# Altium project LEDMatrix-PCB.PrjPcb
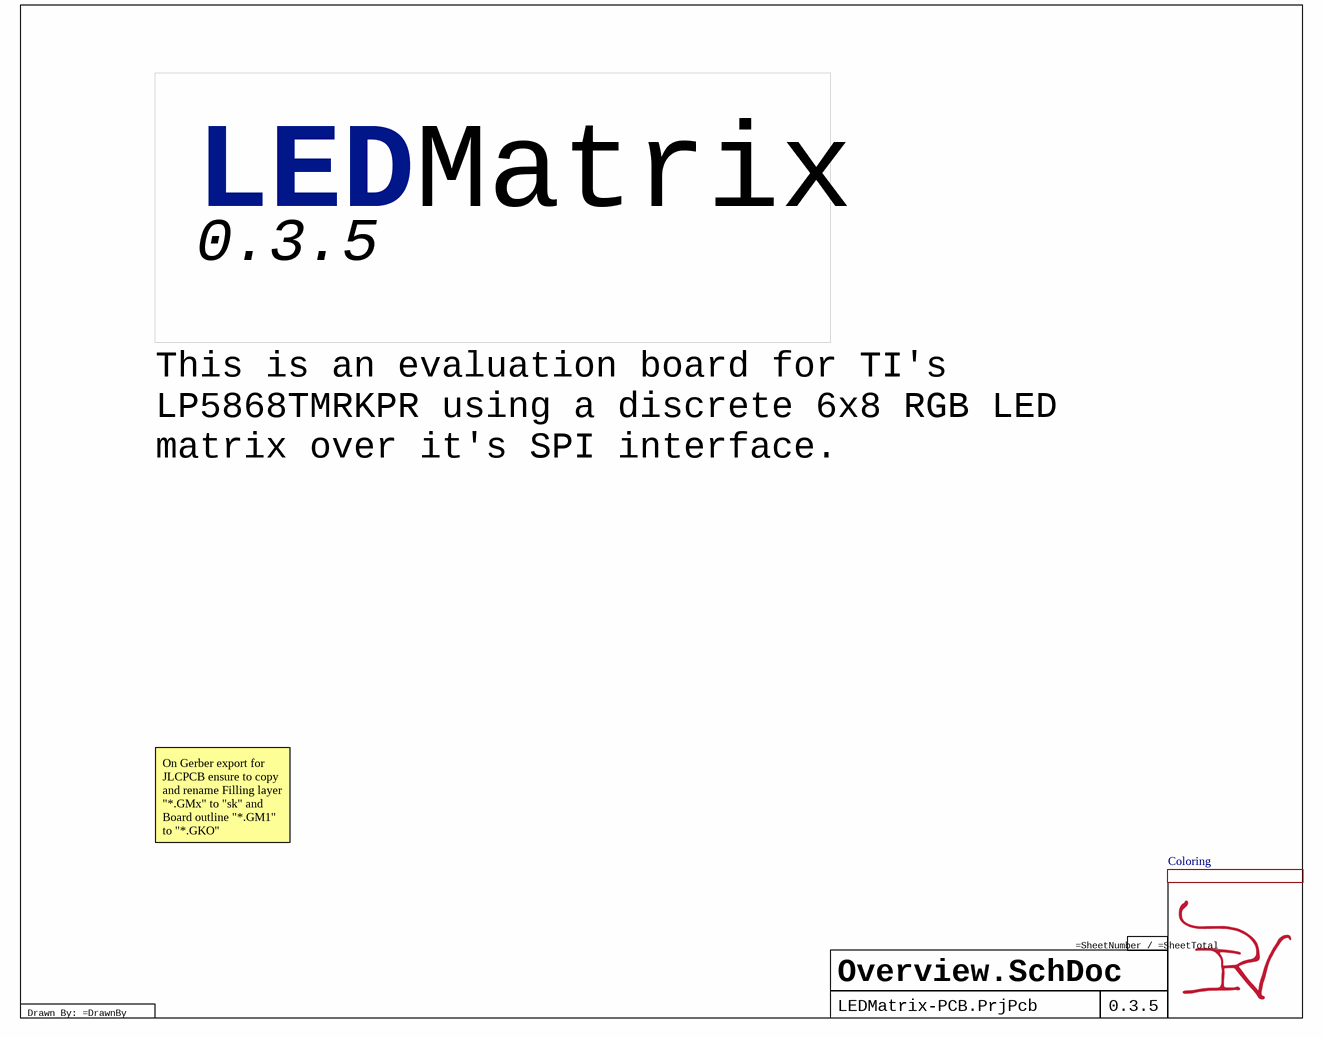
[diagram p0: Overview.SchDoc]
Version: 0.3.5; Project: LEDMatrix; LicenceYear: Copyright © 2024; Licence: Licenced under CERN-OHL-P v2; DrawnBy: IR; Author: IR
6 sheets, 59 parts. Net scope: flat (ports and power ports of the same name join across sheets).
Board file: LEDMatrix.PcbDoc
Sheets:
  Overview.SchDoc
    LINK_ME_AND_HIDE_DESIGNATOR = LEDMatrix.SchDoc
      Controller = Controller.SchDoc
      Matrix = Matrix.SchDoc
      Connectors = Connectors.SchDoc
    Coloring = Coloring.SchDoc

## Sheet Overview.SchDoc: PMPi-PCB
size A; SheetNumber: 1; SheetTotal: 6

### Sub-sheets
Coloring = Coloring.SchDoc: no entries
LINK_ME_AND_HIDE_DESIGNATOR = LEDMatrix.SchDoc: no entries

### Notes on the sheet
- LED
- This is an evaluation board for TI's LP5868TMRKPR using a discrete 6x8 RGB LED matrix over it's SPI interface.
- On Gerber export for JLCPCB ensure to copy and rename Filling layer "*.GMx" to "sk" and Board outline "*.GM1" to "*.GKO"
- Drawn By: =DrawnBy

## Sheet LEDMatrix.SchDoc
size A; SheetNumber: 2; SheetTotal: 6
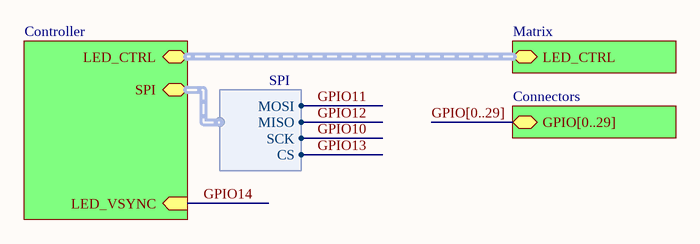
[diagram p1: LEDMatrix.SchDoc]

### Sub-sheets
Connectors = Connectors.SchDoc: GPIO[0..29] (bidir)
Controller = Controller.SchDoc: LED_CTRL (bidir, harness LED_CTRL), LED_VSYNC (in), SPI (bidir, harness SPI)
Matrix = Matrix.SchDoc: LED_CTRL (bidir, harness LED_CTRL)

### Harnesses
SPI: MOSI, MISO, SCK, CS

### Buses and harness runs
bus GPIO[0..29] = sheet Connectors/GPIO[0..29]
harness sheet Controller/LED_CTRL = sheet Matrix/LED_CTRL

### Notes on the sheet
- Drawn By: =DrawnBy

## Sheet Controller.SchDoc
size A; SheetNumber: 4; SheetTotal: 6
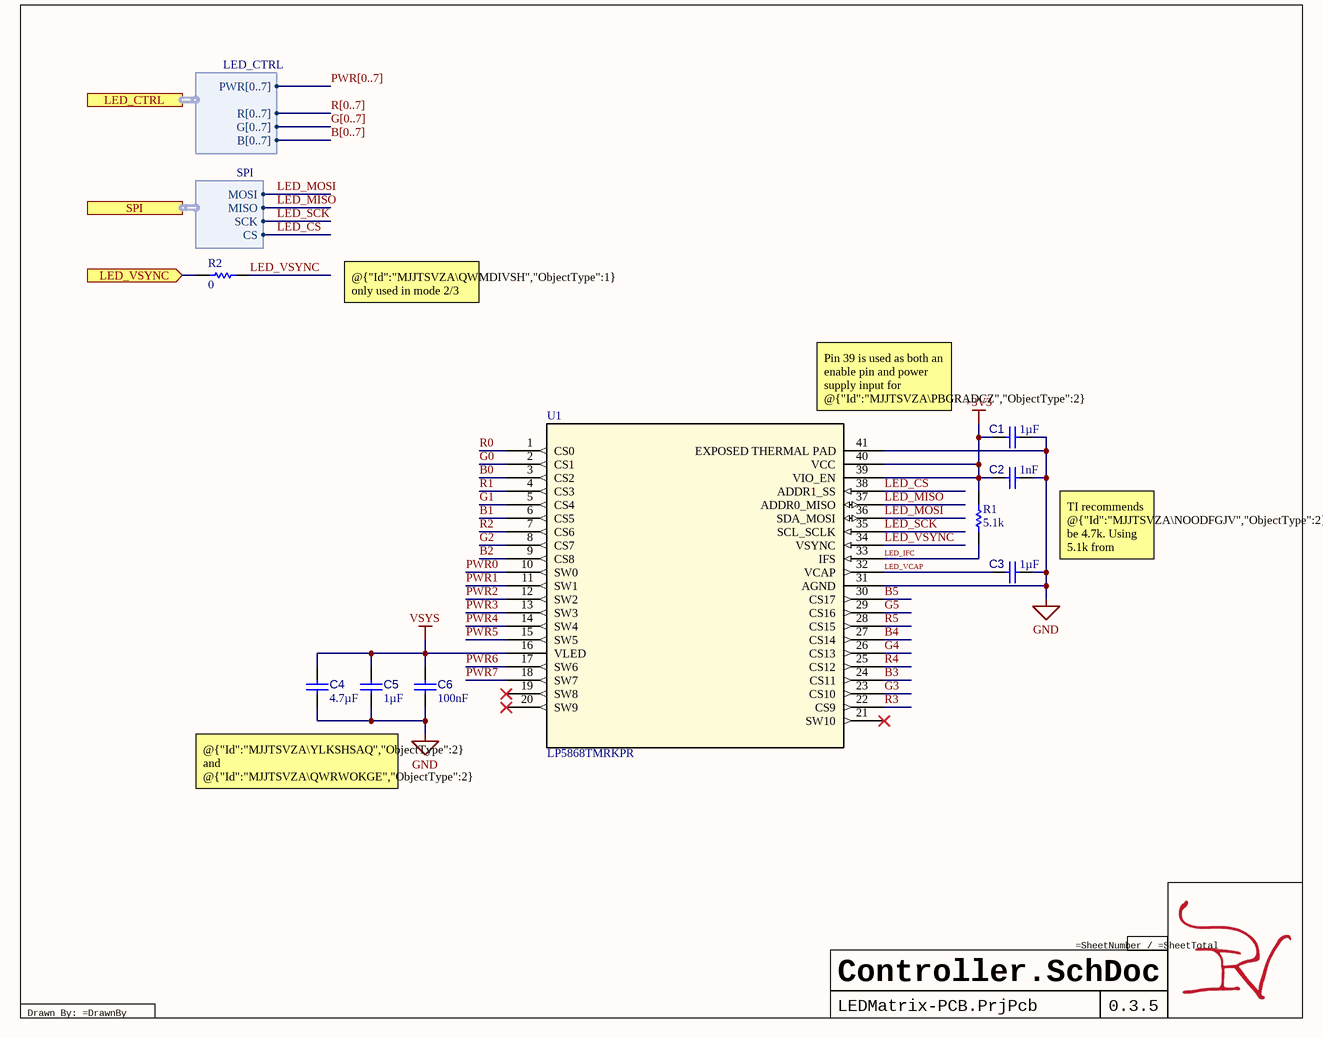
[diagram p2: Controller.SchDoc]

### Parts
C1  value 1µF  [CAP 0201_0603]  (hidden comment: GRM033R60J105MEA2D)
C2  value 1nF  [CAP 0402_1005]  (hidden comment: GRM1555C1H102JA01D)
C3  value 1µF  [CAP 0201_0603]  (hidden comment: GRM033R60J105MEA2D)
C4  value 4.7µF  [CAP 0402_1005]  (hidden comment: CL05A475MP5NRNC)
C5  value 1µF  [CAP 0201_0603]  (hidden comment: GRM033R60J105MEA2D)
C6  value 100nF  [CAP 0201_0603]  (hidden comment: CL03A104KQ3NNNC)
R1  value 5.1k  [RES 0201_0603]  (hidden comment: 5k1-0201-0.05/1)
R2  value 0  [RES 0402_1005]  (hidden comment: 0-0402-0.1)
U1  LP5868TMRKPR  [VQFN40-RKP_TEX]

### Ports
LED_CTRL (harness LED_CTRL, see LEDMatrix[2B], Matrix[1A]), LED_VSYNC (in, see LEDMatrix[2B]), SPI (harness SPI, see LEDMatrix[2B])

### Harnesses
LED_CTRL: PWR[0..7], R[0..7], B[0..7], G[0..7]
SPI: MOSI, MISO, SCK, CS

### Nets
+3V3: C1.2 C2.2 R1.2 U1.39(VIO_EN) U1.40(VCC)
GND: C1.1 C2.1 C3.2 C4.2 C5.1 C6.1 U1.31(AGND) U1.41(EXPOSED_THERMAL_PAD)
VSYS: C4.1 C5.2 C6.2 U1.16(VLED)
B0: U1.3(CS2)
B1: U1.6(CS5)
B2: U1.9(CS8)
B3: U1.24(CS11)
B4: U1.27(CS14)
B5: U1.30(CS17)
G0: U1.2(CS1)
G1: U1.5(CS4)
G2: U1.8(CS7)
G3: U1.23(CS10)
G4: U1.26(CS13)
G5: U1.29(CS16)
LED_CS: U1.38(ADDR1_SS) ; port SPI.CS
LED_IFC: R1.1 U1.33(IFS)
LED_MISO: U1.37(ADDR0_MISO) ; port SPI.MISO
LED_MOSI: U1.36(SDA_MOSI) ; port SPI.MOSI
LED_SCK: U1.35(SCL_SCLK) ; port SPI.SCK
LED_VCAP: C3.1 U1.32(VCAP)
LED_VSYNC: R2.2 U1.34(VSYNC)
LED_VSYNC: R2.1 ; port LED_VSYNC  [a separate net that carries the same name]
PWR0: U1.10(SW0)
PWR1: U1.11(SW1)
PWR2: U1.12(SW2)
PWR3: U1.13(SW3)
PWR4: U1.14(SW4)
PWR5: U1.15(SW5)
PWR6: U1.17(SW6)
PWR7: U1.18(SW7)
R0: U1.1(CS0)
R1: U1.4(CS3)
R2: U1.7(CS6)
R3: U1.22(CS9)
R4: U1.25(CS12)
R5: U1.28(CS15)

Not connected (* = marked no-connect by the designer): U1 19(SW8)* 20(SW9)* 21(SW10)*

### Buses and harness runs
bus B[0..7]
bus G[0..7]
bus PWR[0..7]
bus R[0..7]

### Notes on the sheet
- @{"Id":"MJJTSVZA\QWMDIVSH","ObjectType":1} only used in mode 2/3
- Pin 39 is used as both an enable pin and power supply input for @{"Id":"MJJTSVZA\PBGRADCZ","ObjectType":2} digital circuits
- TI recommends @{"Id":"MJJTSVZA\NOODFGJV","ObjectType":2} be 4.7k. Using 5.1k from @{"Id":"WRNONFHP\BOMUHTAU","ObjectType":2}
- @{"Id":"MJJTSVZA\YLKSHSAQ","ObjectType":2} and @{"Id":"MJJTSVZA\QWRWOKGE","ObjectType":2} were not in typical circuit, but have been added to help with power input from USB
- Drawn By: =DrawnBy

### Library data of the parts
C1 C3 C5 = CMP-001-00030-2: Ceramic Capacitor, Multilayer, Ceramic, 6.3V, 20% +Tol, 20% -Tol, X5R, 15% TC, 1uF, Surface Mount, 0201; Multilayer: Yes; Reach SVHC Compliant: Yes; Min Operating Temperature: -55°C; Mounting Technology: Surface Mount; Temperature Characteristics Code: X5R; Tolerance (fill in as +-): 20%; Capacitor Type: Ceramic; Pins: 2; Tolerance  (fill in as +-): 20%; RoHS Compliant: Yes; JESD-609 Code: e3; Package Shape: Rectangular; Dielectric Material: Ceramic; Max Operating Temperature: 85°C; Packaging: Tape and Reel; Terminal Finish: Nickel; Rated DC Voltage (URdc): 6.3V; Case/Package: 0201; Termination: Wraparound
C2 = CMP-001-00027-1: Ceramic Capacitor, Multilayer, Ceramic, 50V, 5% +Tol, 5% -Tol, C0G, 30ppm/Cel TC, 0.001uF, Surface Mount, 0402; Multilayer: Yes; Case/Package: 0402; Tolerance  (fill in as +-): 5%; Capacitor Type: Ceramic; Height: 0.5mm; Rated DC Voltage (URdc): 50V; Terminal Finish: Nickel; Tolerance (fill in as +-): 5%; RoHS Compliant: Yes; Package Shape: Rectangular; Length: 1mm; Package Style: SMTMeter; Packaging: Tape and Reel; Max Operating Temperature: 125°C; Temperature Characteristics Code: C0G; Pins: 2; Mounting Technology: Surface Mount; Termination: Wraparound; JESD-609 Code: e3; Width: 0.5mm; Min Operating Temperature: -55°C; Dielectric Material: Ceramic; Reach SVHC Compliant: Yes
C4 = CMP-001-00020-1: Ceramic Capacitor, Multilayer, Ceramic, 10V, 20% +Tol, 20% -Tol, X5R, 15% TC, 4.7uF, Surface Mount, 0402; Multilayer: Yes; Terminal Finish: Nickel; JESD-609 Code: e3; Tolerance (fill in as +-): 20%; Case/Package: 0402; Max Operating Temperature: 85°C; Tolerance  (fill in as +-): 20%; Temperature Characteristics Code: X5R; Packaging: Tape and Reel; Mounting Technology: Surface Mount; Width: 0.5mm; Pins: 2; Min Operating Temperature: -55°C; Package Style: SMTMeter; Capacitor Type: Ceramic; RoHS Compliant: Yes; Height: 0.65mm; Rated DC Voltage (URdc): 10V; Termination: Wraparound; Dielectric Material: Ceramic; Reach SVHC Compliant: Yes; Package Shape: Rectangular; Length: 1mm
C6 = CMP-001-00029-1: Ceramic Capacitor, Multilayer, Ceramic, 6.3V, 10% +Tol, 10% -Tol, X5R, 15% TC, 0.1uF, Surface Mount, 0201; Multilayer: Yes; Temperature Characteristics Code: X5R; Capacitor Type: Ceramic; Min Operating Temperature: -55°C; Reach SVHC Compliant: Yes; Termination: Wraparound; Mounting Technology: Surface Mount; Terminal Finish: Nickel; Pins: 2; JESD-609 Code: e3; Rated DC Voltage (URdc): 6.3V; Case/Package: 0201; Packaging: Tape and Reel; Tolerance  (fill in as +-): 10%; Height: 0.3mm; Length: 0.6mm; Package Shape: Rectangular; Max Operating Temperature: 85°C; Package Style: SMTMeter; Tolerance (fill in as +-): 10%; RoHS Compliant: Yes; Dielectric Material: Ceramic; Width: 0.3mm
R1 = CMP-009-00053-1: Fixed Resistor, Metal Glaze/thick Film, 0.05W, 5100ohm, 25V, 1% +/-Tol, 200ppm/Cel, Surface Mount, 0201; Power: 50mW; Reference Standard: AEC-Q200; Temperature Coefficient: 200ppm/°C; Package Width: 0.3mm; Rated Temperature: 70°C; Package Height: 0.23mm; Package Length: 0.6mm; Min Operating Temperature: -55°C; Max Operating Temperature: 125°C; Tolerance: 1%; Pins: 2; Case/Package: 0201; Construction: Rectangular; Packaging: Tape and Reel; JESD-609 Code: e3; Terminal Finish: Nickel; Termination: Wraparound; Package Style: SMTMeter; Working Voltage: 25V; Package Shape: Rectangular; Resistor Type: FIXED RESISTOR; RoHS Compliant: Yes; Reach SVHC Compliant: Yes; Mounting Technology: Surface Mount; Technology: METAL GLAZE/THICK FILM
R2 = CMP-009-00062-1: Fixed Resistor, Metal Glaze/thick Film, 0.1W, 0ohm, Surface Mount, 0402; Package Width: 0.5mm; Power: 100mW; Tolerance: 1%; Rated Temperature: 70°C; Package Length: 1mm; Reference Standard: AEC-Q200; Package Height: 0.35mm; Temperature Coefficient: 100ppm/°C; Working Voltage: 50V; Min Operating Temperature: -55°C; Package Style: SMTMeter; Reach SVHC Compliant: Yes; Technology: METAL GLAZE/THICK FILM; Resistor Type: FIXED RESISTOR; JESD-609 Code: e3; Construction: Rectangular; Package Shape: Rectangular; RoHS Compliant: Yes; Pins: 2; Terminal Finish: Nickel; Case/Package: 0402; Max Operating Temperature: 155°C; Packaging: Tape and Reel; Termination: Wraparound; Mounting Technology: Surface Mount
U1 = CMP-776-000000-2: 8 x 18 high-current LED matrix driver with 8-bit analog and 8-/16-bit PWM dimming; Mfr_Name: Texas Instruments; RefDes: RefDes; Source: LP5868TMRKPR.SchLib; Type: Power Management; Design Item ID: LP5868TMRKPR

## Sheet Matrix.SchDoc
size A3; SheetNumber: 5; SheetTotal: 6
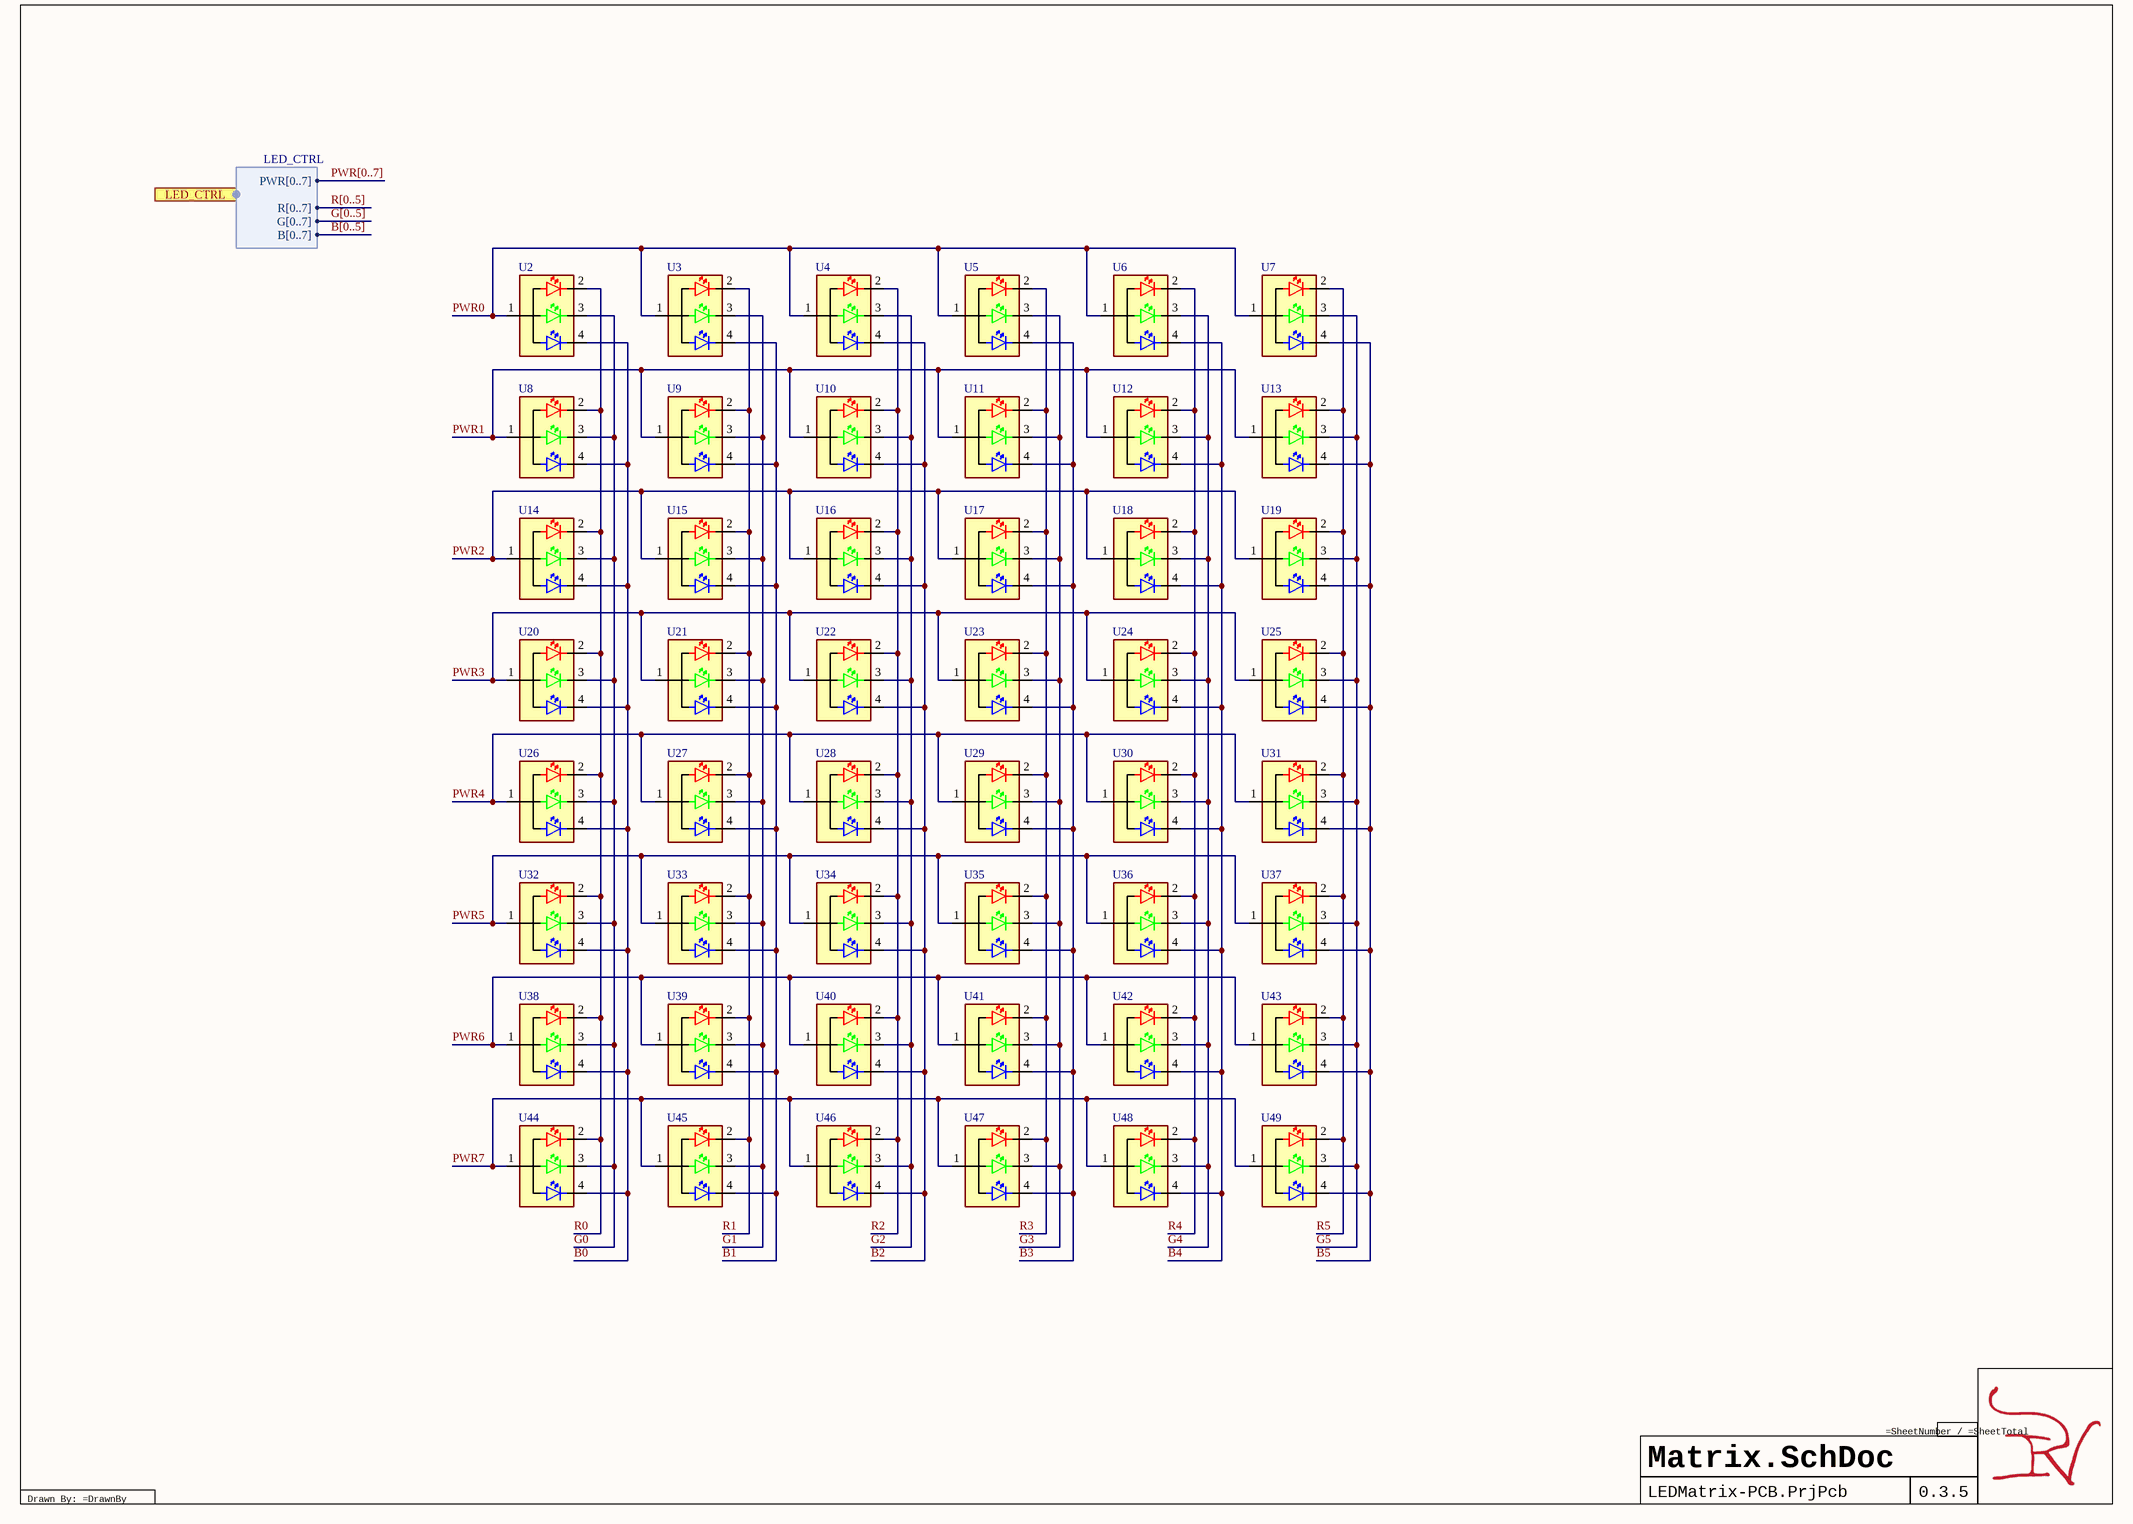
[diagram p3: Matrix.SchDoc]

### Parts
U2  B36J3RGB-F6C0001H4U1930  [B36J3RGB-F6C0001H4U1930-Footprint-1]  (value not drawn)
U3  B36J3RGB-F6C0001H4U1930  [B36J3RGB-F6C0001H4U1930-Footprint-1]  (value not drawn)
U4  B36J3RGB-F6C0001H4U1930  [B36J3RGB-F6C0001H4U1930-Footprint-1]  (value not drawn)
U5  B36J3RGB-F6C0001H4U1930  [B36J3RGB-F6C0001H4U1930-Footprint-1]  (value not drawn)
U6  B36J3RGB-F6C0001H4U1930  [B36J3RGB-F6C0001H4U1930-Footprint-1]  (value not drawn)
U7  B36J3RGB-F6C0001H4U1930  [B36J3RGB-F6C0001H4U1930-Footprint-1]  (value not drawn)
U8  B36J3RGB-F6C0001H4U1930  [B36J3RGB-F6C0001H4U1930-Footprint-1]  (value not drawn)
U9  B36J3RGB-F6C0001H4U1930  [B36J3RGB-F6C0001H4U1930-Footprint-1]  (value not drawn)
U10  B36J3RGB-F6C0001H4U1930  [B36J3RGB-F6C0001H4U1930-Footprint-1]  (value not drawn)
U11  B36J3RGB-F6C0001H4U1930  [B36J3RGB-F6C0001H4U1930-Footprint-1]  (value not drawn)
U12  B36J3RGB-F6C0001H4U1930  [B36J3RGB-F6C0001H4U1930-Footprint-1]  (value not drawn)
U13  B36J3RGB-F6C0001H4U1930  [B36J3RGB-F6C0001H4U1930-Footprint-1]  (value not drawn)
U14  B36J3RGB-F6C0001H4U1930  [B36J3RGB-F6C0001H4U1930-Footprint-1]  (value not drawn)
U15  B36J3RGB-F6C0001H4U1930  [B36J3RGB-F6C0001H4U1930-Footprint-1]  (value not drawn)
U16  B36J3RGB-F6C0001H4U1930  [B36J3RGB-F6C0001H4U1930-Footprint-1]  (value not drawn)
U17  B36J3RGB-F6C0001H4U1930  [B36J3RGB-F6C0001H4U1930-Footprint-1]  (value not drawn)
U18  B36J3RGB-F6C0001H4U1930  [B36J3RGB-F6C0001H4U1930-Footprint-1]  (value not drawn)
U19  B36J3RGB-F6C0001H4U1930  [B36J3RGB-F6C0001H4U1930-Footprint-1]  (value not drawn)
U20  B36J3RGB-F6C0001H4U1930  [B36J3RGB-F6C0001H4U1930-Footprint-1]  (value not drawn)
U21  B36J3RGB-F6C0001H4U1930  [B36J3RGB-F6C0001H4U1930-Footprint-1]  (value not drawn)
U22  B36J3RGB-F6C0001H4U1930  [B36J3RGB-F6C0001H4U1930-Footprint-1]  (value not drawn)
U23  B36J3RGB-F6C0001H4U1930  [B36J3RGB-F6C0001H4U1930-Footprint-1]  (value not drawn)
U24  B36J3RGB-F6C0001H4U1930  [B36J3RGB-F6C0001H4U1930-Footprint-1]  (value not drawn)
U25  B36J3RGB-F6C0001H4U1930  [B36J3RGB-F6C0001H4U1930-Footprint-1]  (value not drawn)
U26  B36J3RGB-F6C0001H4U1930  [B36J3RGB-F6C0001H4U1930-Footprint-1]  (value not drawn)
U27  B36J3RGB-F6C0001H4U1930  [B36J3RGB-F6C0001H4U1930-Footprint-1]  (value not drawn)
U28  B36J3RGB-F6C0001H4U1930  [B36J3RGB-F6C0001H4U1930-Footprint-1]  (value not drawn)
U29  B36J3RGB-F6C0001H4U1930  [B36J3RGB-F6C0001H4U1930-Footprint-1]  (value not drawn)
U30  B36J3RGB-F6C0001H4U1930  [B36J3RGB-F6C0001H4U1930-Footprint-1]  (value not drawn)
U31  B36J3RGB-F6C0001H4U1930  [B36J3RGB-F6C0001H4U1930-Footprint-1]  (value not drawn)
U32  B36J3RGB-F6C0001H4U1930  [B36J3RGB-F6C0001H4U1930-Footprint-1]  (value not drawn)
U33  B36J3RGB-F6C0001H4U1930  [B36J3RGB-F6C0001H4U1930-Footprint-1]  (value not drawn)
U34  B36J3RGB-F6C0001H4U1930  [B36J3RGB-F6C0001H4U1930-Footprint-1]  (value not drawn)
U35  B36J3RGB-F6C0001H4U1930  [B36J3RGB-F6C0001H4U1930-Footprint-1]  (value not drawn)
U36  B36J3RGB-F6C0001H4U1930  [B36J3RGB-F6C0001H4U1930-Footprint-1]  (value not drawn)
U37  B36J3RGB-F6C0001H4U1930  [B36J3RGB-F6C0001H4U1930-Footprint-1]  (value not drawn)
U38  B36J3RGB-F6C0001H4U1930  [B36J3RGB-F6C0001H4U1930-Footprint-1]  (value not drawn)
U39  B36J3RGB-F6C0001H4U1930  [B36J3RGB-F6C0001H4U1930-Footprint-1]  (value not drawn)
U40  B36J3RGB-F6C0001H4U1930  [B36J3RGB-F6C0001H4U1930-Footprint-1]  (value not drawn)
U41  B36J3RGB-F6C0001H4U1930  [B36J3RGB-F6C0001H4U1930-Footprint-1]  (value not drawn)
U42  B36J3RGB-F6C0001H4U1930  [B36J3RGB-F6C0001H4U1930-Footprint-1]  (value not drawn)
U43  B36J3RGB-F6C0001H4U1930  [B36J3RGB-F6C0001H4U1930-Footprint-1]  (value not drawn)
U44  B36J3RGB-F6C0001H4U1930  [B36J3RGB-F6C0001H4U1930-Footprint-1]  (value not drawn)
U45  B36J3RGB-F6C0001H4U1930  [B36J3RGB-F6C0001H4U1930-Footprint-1]  (value not drawn)
U46  B36J3RGB-F6C0001H4U1930  [B36J3RGB-F6C0001H4U1930-Footprint-1]  (value not drawn)
U47  B36J3RGB-F6C0001H4U1930  [B36J3RGB-F6C0001H4U1930-Footprint-1]  (value not drawn)
U48  B36J3RGB-F6C0001H4U1930  [B36J3RGB-F6C0001H4U1930-Footprint-1]  (value not drawn)
U49  B36J3RGB-F6C0001H4U1930  [B36J3RGB-F6C0001H4U1930-Footprint-1]  (value not drawn)

### Ports
LED_CTRL (harness LED_CTRL, see LEDMatrix[3B], Controller[1A])

### Harnesses
LED_CTRL: PWR[0..7], R[0..7], B[0..7], G[0..7]

### Nets
B0: U2.4 U8.4 U14.4 U20.4 U26.4 U32.4 U38.4 U44.4
B1: U3.4 U9.4 U15.4 U21.4 U27.4 U33.4 U39.4 U45.4
B2: U4.4 U10.4 U16.4 U22.4 U28.4 U34.4 U40.4 U46.4
B3: U5.4 U11.4 U17.4 U23.4 U29.4 U35.4 U41.4 U47.4
B4: U6.4 U12.4 U18.4 U24.4 U30.4 U36.4 U42.4 U48.4
B5: U7.4 U13.4 U19.4 U25.4 U31.4 U37.4 U43.4 U49.4
G0: U2.3 U8.3 U14.3 U20.3 U26.3 U32.3 U38.3 U44.3
G1: U3.3 U9.3 U15.3 U21.3 U27.3 U33.3 U39.3 U45.3
G2: U4.3 U10.3 U16.3 U22.3 U28.3 U34.3 U40.3 U46.3
G3: U5.3 U11.3 U17.3 U23.3 U29.3 U35.3 U41.3 U47.3
G4: U6.3 U12.3 U18.3 U24.3 U30.3 U36.3 U42.3 U48.3
G5: U7.3 U13.3 U19.3 U25.3 U31.3 U37.3 U43.3 U49.3
PWR0: U2.1 U3.1 U4.1 U5.1 U6.1 U7.1
PWR1: U8.1 U9.1 U10.1 U11.1 U12.1 U13.1
PWR2: U14.1 U15.1 U16.1 U17.1 U18.1 U19.1
PWR3: U20.1 U21.1 U22.1 U23.1 U24.1 U25.1
PWR4: U26.1 U27.1 U28.1 U29.1 U30.1 U31.1
PWR5: U32.1 U33.1 U34.1 U35.1 U36.1 U37.1
PWR6: U38.1 U39.1 U40.1 U41.1 U42.1 U43.1
PWR7: U44.1 U45.1 U46.1 U47.1 U48.1 U49.1
R0: U2.2 U8.2 U14.2 U20.2 U26.2 U32.2 U38.2 U44.2
R1: U3.2 U9.2 U15.2 U21.2 U27.2 U33.2 U39.2 U45.2
R2: U4.2 U10.2 U16.2 U22.2 U28.2 U34.2 U40.2 U46.2
R3: U5.2 U11.2 U17.2 U23.2 U29.2 U35.2 U41.2 U47.2
R4: U6.2 U12.2 U18.2 U24.2 U30.2 U36.2 U42.2 U48.2
R5: U7.2 U13.2 U19.2 U25.2 U31.2 U37.2 U43.2 U49.2

### Buses and harness runs
bus B[0..5]
bus G[0..5]
bus PWR[0..7]
bus R[0..5]

### Notes on the sheet
- Drawn By: =DrawnBy

### Library data of the parts
U2-U49 = CMP-007-00001-4: Led Rgb Common Anode (0.65(L)X 0

## Sheet Connectors.SchDoc
size A; SheetNumber: 5; SheetTotal: 6
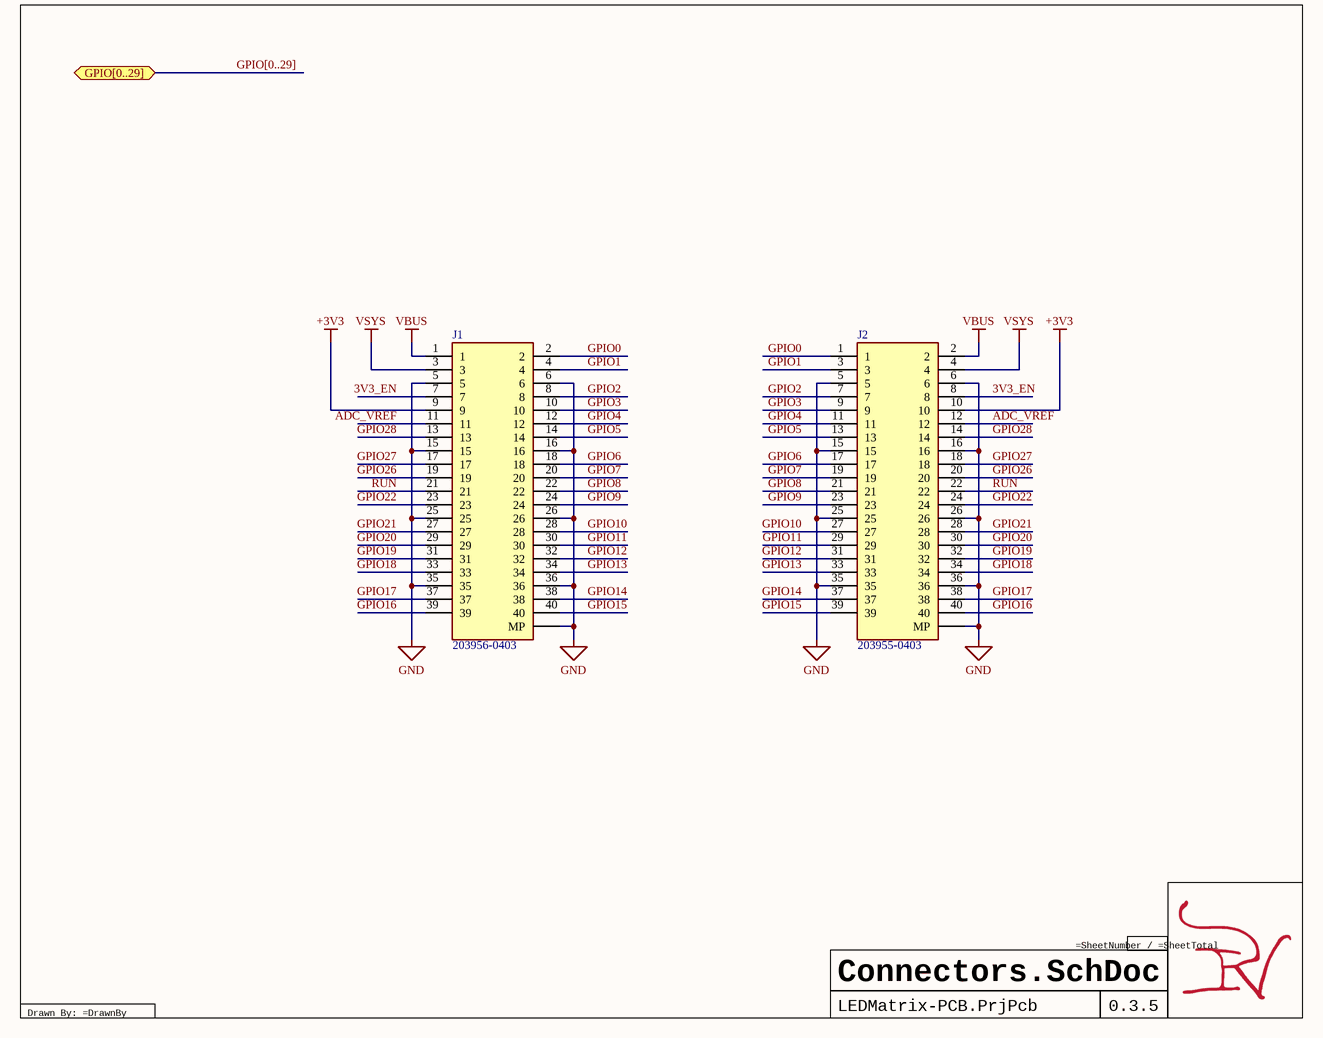
[diagram p4: Connectors.SchDoc]

### Parts
J1  203956-0403  [2039560403]
J2  203955-0403  [2039550403]

### Ports
GPIO[0..29] (bidir, see LEDMatrix[3B], Controller[1B])

### Nets
+3V3: J1.9 J2.10
GND: J1.5 J1.6 J1.15 J1.16 J1.25 J1.26 J1.35 J1.36 J1.MP1,_MP2,_MP3,_MP4(MP) J2.5 J2.6 J2.15 J2.16 J2.25 J2.26 J2.35 J2.36 J2.MP1,_MP2,_MP3,_MP4(MP)
VBUS: J1.1 J2.2
VSYS: J1.3 J2.4
3V3_EN: J1.7 J2.8
ADC_VREF: J1.11 J2.12
GPIO0: J1.2 J2.1
GPIO1: J1.4 J2.3
GPIO2: J1.8 J2.7
GPIO3: J1.10 J2.9
GPIO4: J1.12 J2.11
GPIO5: J1.14 J2.13
GPIO6: J1.18 J2.17
GPIO7: J1.20 J2.19
GPIO8: J1.22 J2.21
GPIO9: J1.24 J2.23
GPIO10: J1.28 J2.27
GPIO11: J1.30 J2.29
GPIO12: J1.32 J2.31
GPIO13: J1.34 J2.33
GPIO14: J1.38 J2.37
GPIO15: J1.40 J2.39
GPIO16: J1.39 J2.40
GPIO17: J1.37 J2.38
GPIO18: J1.33 J2.34
GPIO19: J1.31 J2.32
GPIO20: J1.29 J2.30
GPIO21: J1.27 J2.28
GPIO22: J1.23 J2.24
GPIO26: J1.19 J2.20
GPIO27: J1.17 J2.18
GPIO28: J1.13 J2.14
RUN: J1.21 J2.22

### Buses and harness runs
bus GPIO[0..29] = port GPIO[0..29]

### Notes on the sheet
- Drawn By: =DrawnBy

### Library data of the parts
J1 = CMP-702-000004-3: SlimStack Board-to-Board Plug, 0.40mm Pitch, FSB5 Floating Series, 5.00mm Mated Height, 3.80 Mated Width, 40 Circuits; Manufacturer_Name: Molex; Source: SamacSys.SchLib; Datasheet Link: https://www.molex.com/pdm_docs/sd/2039560403_sd.pdf; Height: 4.55mm; Design Item ID: 203956-0403; Manufacturer_Part_Number: 203956-0403; Mouser Price/Stock: https://www.mouser.co.uk/ProductDetail/Molex/203956-0403?qs=GBLSl2AkiruaR3IeSUTGlg%3D%3D; Mouser Part Number: 538-203956-0403
J2 = CMP-702-000003-3: SlimStack Board-to-Board Receptacle, 0.40mm Pitch, FSB5 Floating Series, 5.00mm Mated Height, 3.80mm Mated Width, 40...; Manufacturer_Name: Molex; Mouser Price/Stock: https://www.mouser.co.uk/ProductDetail/Molex/203955-0403?qs=GBLSl2Akirtl%2FPuTWbQ1%252BQ%3D%3D; Height: 3.1mm; Design Item ID: 203955-0403; Mouser Part Number: 538-203955-0403; Manufacturer_Part_Number: 203955-0403; Datasheet Link: https://www.molex.com/pdm_docs/sd/2039550403_sd.pdf; Source: SamacSys.SchLib

## Sheet Coloring.SchDoc
size 88 x 127 mm; SheetNumber: 10; SheetTotal: 10
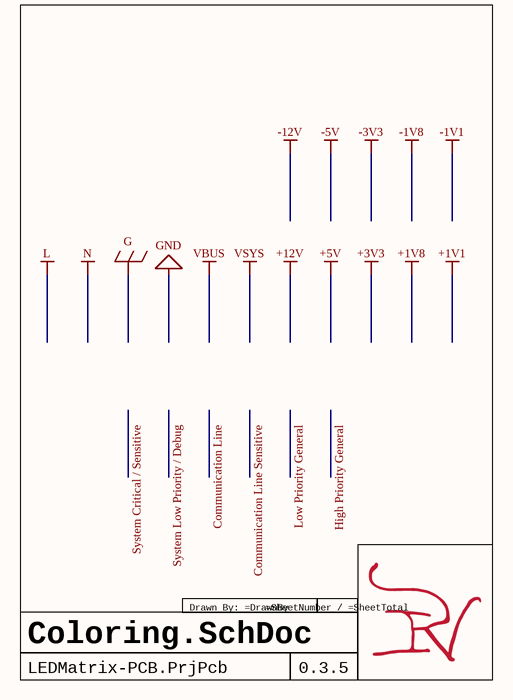
[diagram p5: Coloring.SchDoc]

### Notes on the sheet
- Drawn By: =DrawnBy

## Nets that join several sheets
+3V3: Controller (5 pins), Connectors (J1.9 J2.10)
GND: Controller (8 pins), Connectors (18 pins)
VSYS: Controller (C4.1 C5.2 C6.2 U1.16), Connectors (J1.3 J2.4)
B0: Controller (U1.3), Matrix (8 pins)
B1: Controller (U1.6), Matrix (8 pins)
B2: Controller (U1.9), Matrix (8 pins)
B3: Controller (U1.24), Matrix (8 pins)
B4: Controller (U1.27), Matrix (8 pins)
B5: Controller (U1.30), Matrix (8 pins)
G0: Controller (U1.2), Matrix (8 pins)
G1: Controller (U1.5), Matrix (8 pins)
G2: Controller (U1.8), Matrix (8 pins)
G3: Controller (U1.23), Matrix (8 pins)
G4: Controller (U1.26), Matrix (8 pins)
G5: Controller (U1.29), Matrix (8 pins)
PWR0: Controller (U1.10), Matrix (6 pins)
PWR1: Controller (U1.11), Matrix (6 pins)
PWR2: Controller (U1.12), Matrix (6 pins)
PWR3: Controller (U1.13), Matrix (6 pins)
PWR4: Controller (U1.14), Matrix (6 pins)
PWR5: Controller (U1.15), Matrix (6 pins)
PWR6: Controller (U1.17), Matrix (6 pins)
PWR7: Controller (U1.18), Matrix (6 pins)
R0: Controller (U1.1), Matrix (8 pins)
R1: Controller (U1.4), Matrix (8 pins)
R2: Controller (U1.7), Matrix (8 pins)
R3: Controller (U1.22), Matrix (8 pins)
R4: Controller (U1.25), Matrix (8 pins)
R5: Controller (U1.28), Matrix (8 pins)